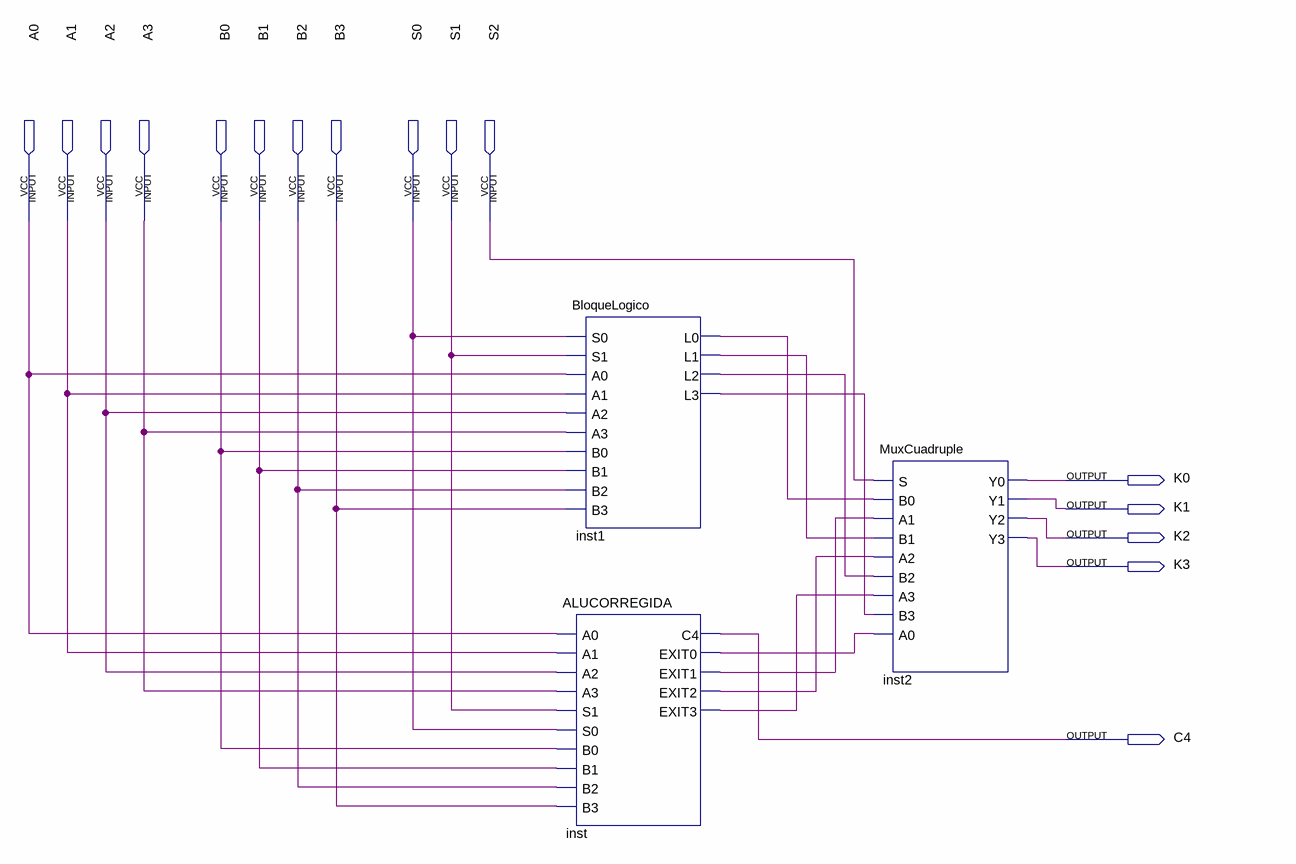
[diagram p0: schematic sheet]
// Quartus schematic ALUCOMPLETA.bdf as structural Verilog: 3 symbols, 16 pins
module ALUCOMPLETA (
  input  A0,
  input  A1,
  input  A2,
  input  A3,
  input  B0,
  input  B1,
  input  B2,
  input  B3,
  input  S0,
  input  S1,
  input  S2,
  output K0,
  output K1,
  output K2,
  output K3,
  output C4
);

  wire inst1_l0, inst1_l1, inst1_l2, inst1_l3, inst_exit0, inst_exit1, inst_exit2, inst_exit3;

  BloqueLogico inst1 (
    .S0(S0), .S1(S1), .A0(A0), .A1(A1), .A2(A2), .A3(A3), .B0(B0), .B1(B1), .B2(B2), .B3(B3), .L0(inst1_l0),
    .L1(inst1_l1), .L2(inst1_l2), .L3(inst1_l3));
  ALUCORREGIDA inst (
    .A0(A0), .A1(A1), .A2(A2), .A3(A3), .S1(S1), .S0(S0), .B0(B0), .B1(B1), .B2(B2), .B3(B3), .C4(C4),
    .EXIT0(inst_exit0), .EXIT1(inst_exit1), .EXIT2(inst_exit2), .EXIT3(inst_exit3));
  MuxCuadruple inst2 (
    .S(S2), .B0(inst1_l0), .A1(inst_exit1), .B1(inst1_l1), .A2(inst_exit2), .B2(inst1_l2), .A3(inst_exit3),
    .B3(inst1_l3), .A0(inst_exit0), .Y0(K0), .Y1(K1), .Y2(K2), .Y3(K3));
endmodule
